# EAGLE design 204_barometer (EAGLE 7.6.0)
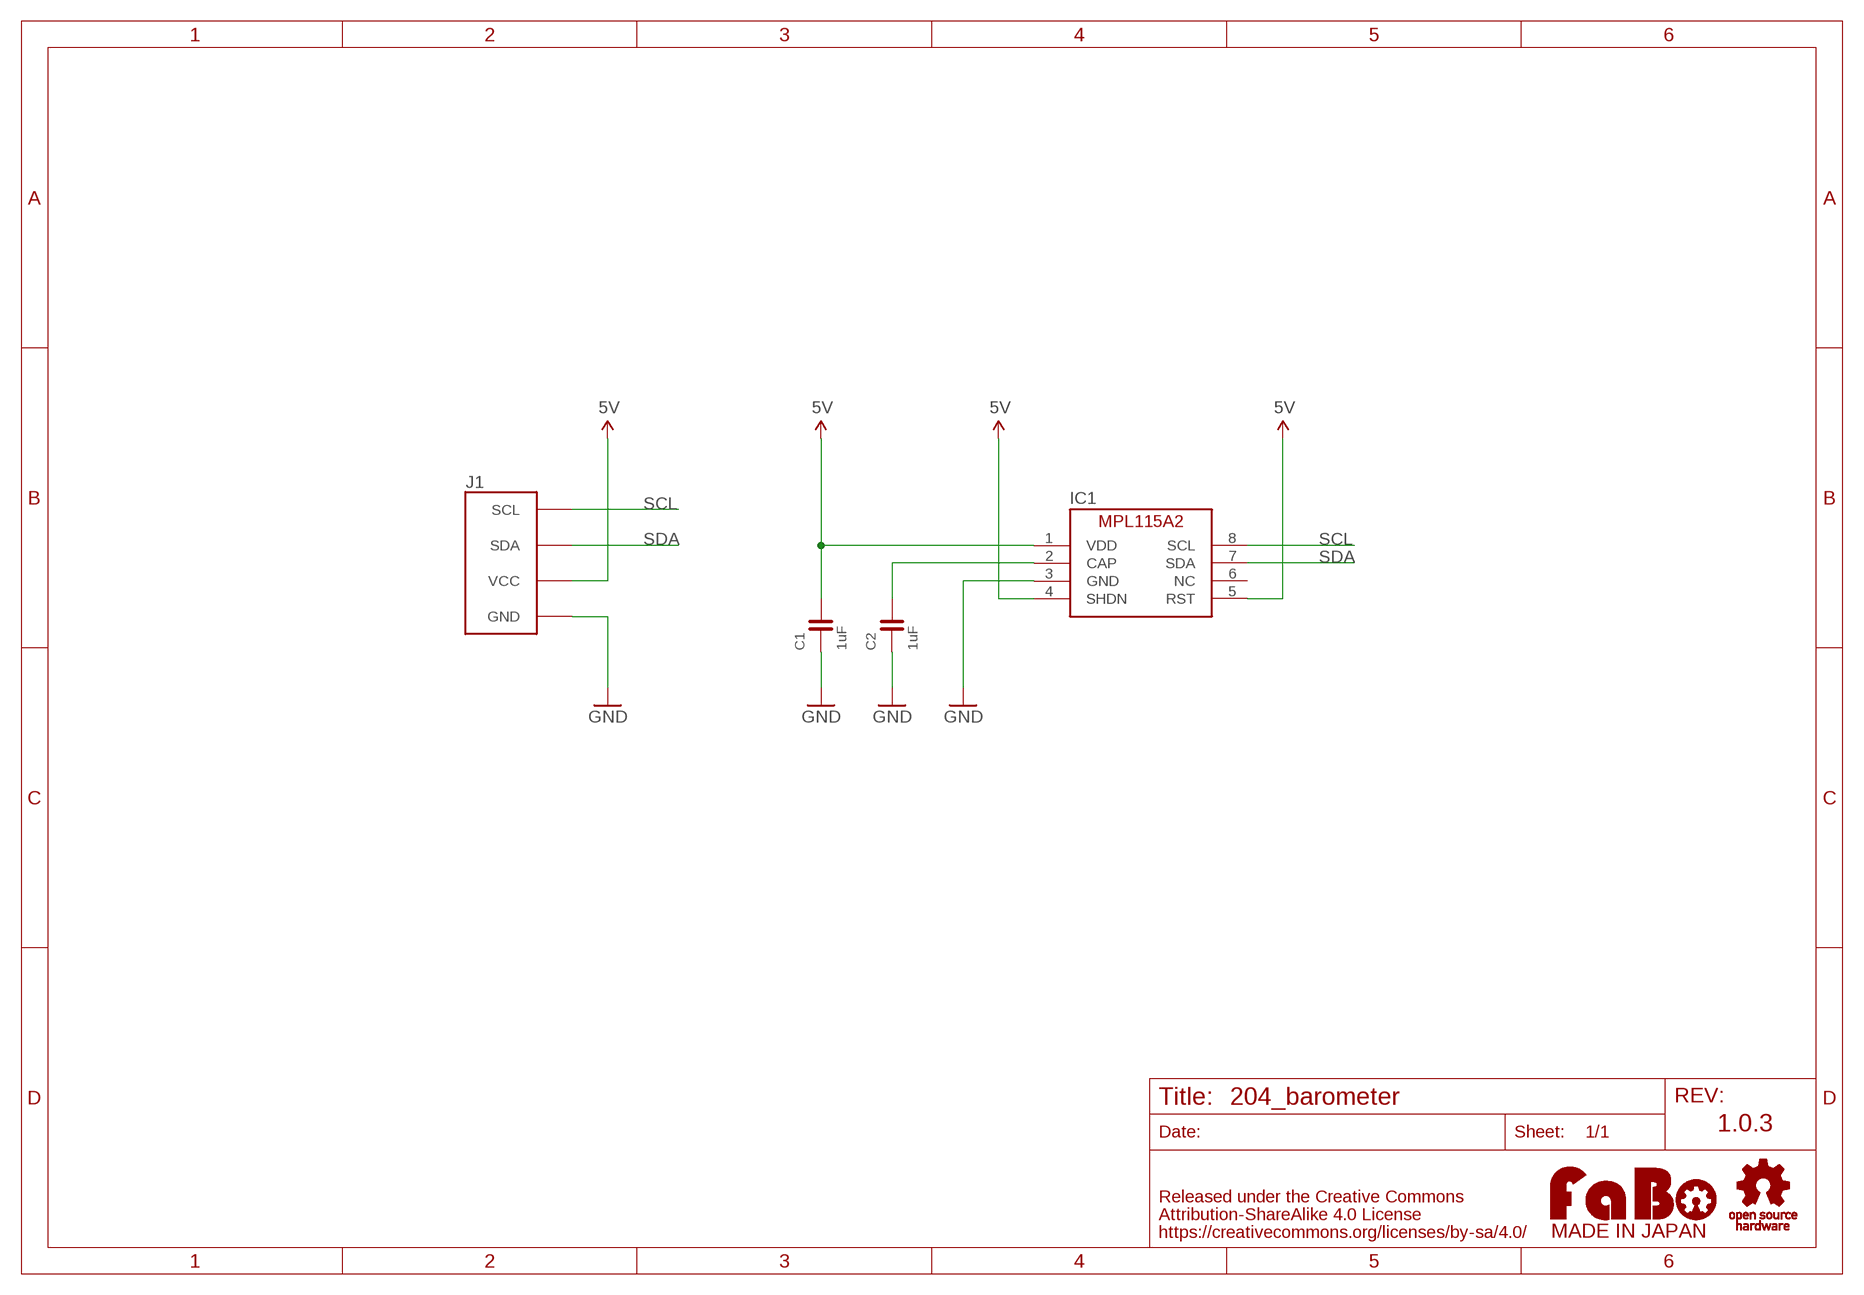
[diagram p0: schematic, sheet 1]

## Parts
C1  1uF  CAPACITOR-0603  [0603]
C2  1uF  CAPACITOR-0603  [0603]
IC1  FS-MPL115A2  [FREESCALE-MPL115A2]
J1  FABO_BRICK_I2C  [FABO_BRICK_I2C]
U$2  LOGO_OSHW-M_BOTTOM  [LOGO_OSHW_M_BOTTOM]
U$4  LOGO_FABO-M  [LOGO_FABO_MS]

## Nets
5V: C1.2 IC1.1(VDD) IC1.4(SHDN) IC1.5(RST) J1.VCC
GND: C1.1 C2.1 IC1.3(GND) J1.GND
N$2: C2.2 IC1.2(CAP)
SCL: IC1.8(SCL) J1.SCL
SDA: IC1.7(SDA) J1.SDA
Unconnected: IC1.6(NC)

## Notes on the sheet
- 1.0.3

## Library data of the parts
C1 C2 = FaBo-Capacitor:CAPACITOR: CAPACITOR
IC1 = FaBo-Mems:FS-MPL115A2: FREESCALE MPL115A2(Atmospheric pressure)
J1 = FaBo-Template:FABO_BRICK_I2C: FaBo Brick I2C
U$2 = FaBo-etc:LOGO_OSHW
U$4 = FaBo-etc:LOGO_FABO

## Board
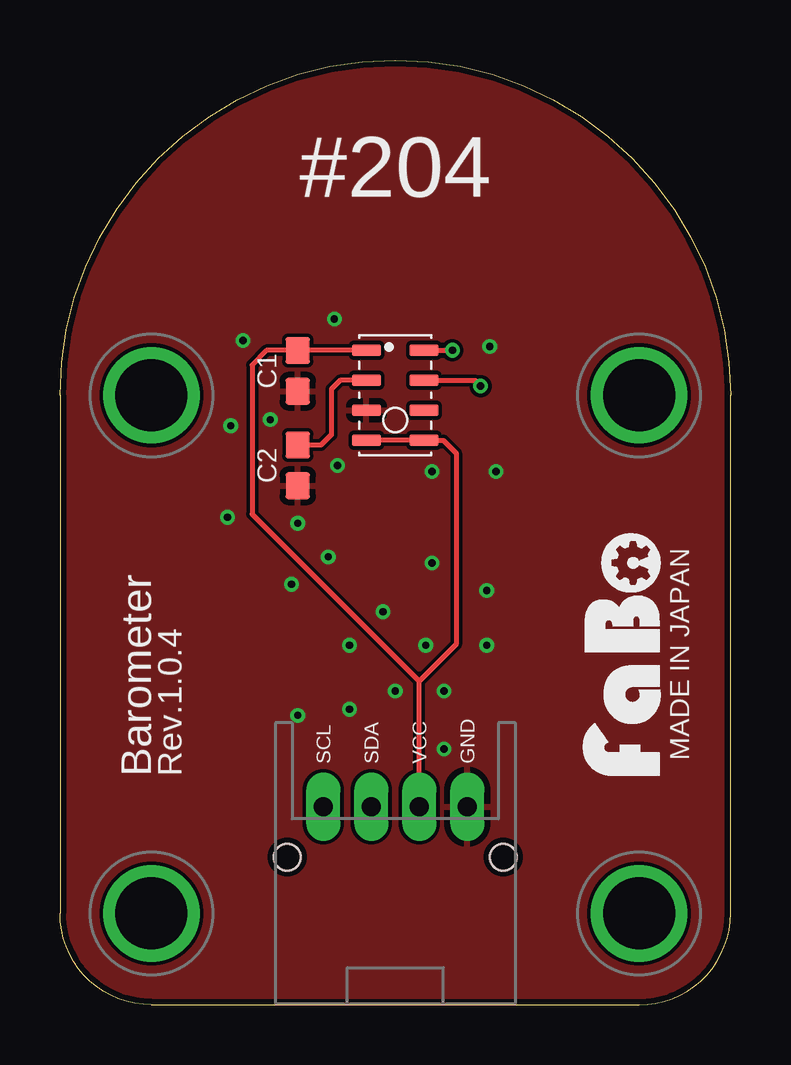
[diagram p1: board, top side]
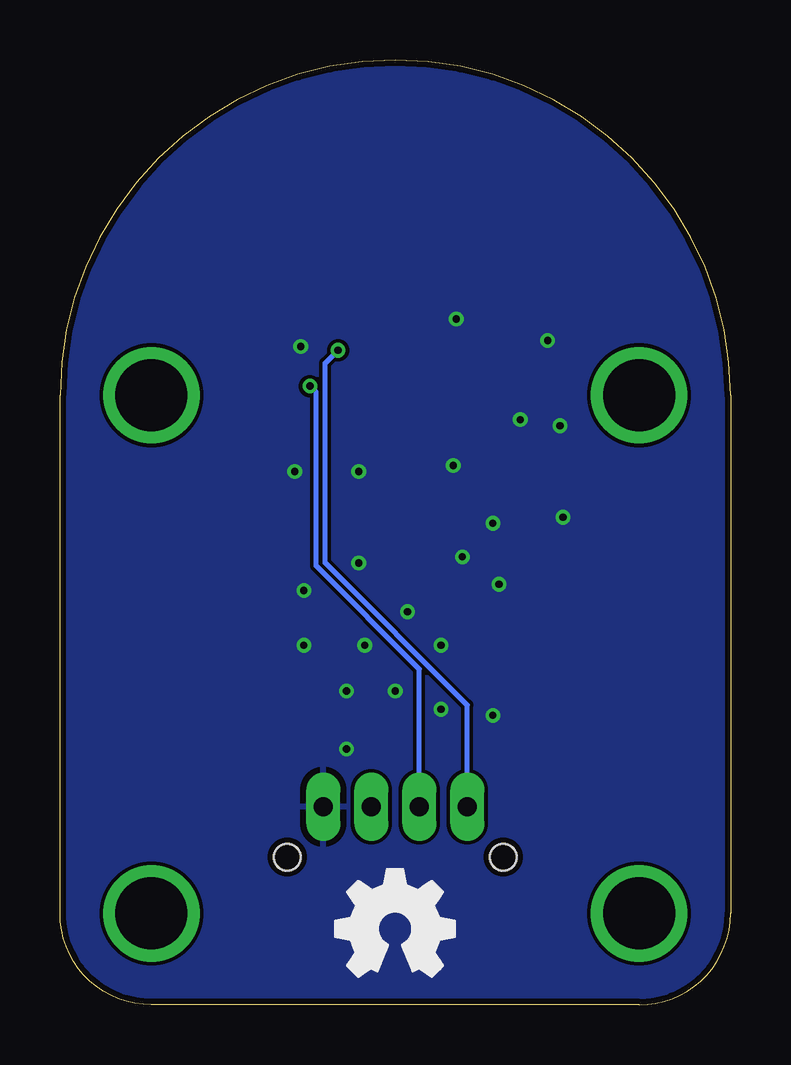
[diagram p2: board, bottom side, seen from below]

Size 27.94 x 39.37 mm. Coordinates in mm from the lower left corner, seen from the top.
Copper layers (1*16): Top 0.035mm / dielectric 1.5mm / Bottom 0.035mm
Design rules "SeeedStudio_2layer_DRU_no_angle_20140221": minimum track width 6mil, minimum drill 12mil, track to track 6mil, track to pad 6mil, pad to pad 6mil, via to via 6mil, smd to smd 0mil, copper to edge 10mil, drill to drill 10mil, minimum pad ring 10mil, minimum via ring 6mil, stop-mask expansion 2mil, vias tented up to drill 100mil, thermal gap 10mil

### Footprints (pad centres in the part's own frame; a part is rotated, then mirrored left to right if it is on the bottom)
0603 = smd 1.1 x 1: 1 -0.85,0; 2 0.85,0
FREESCALE-MPL115A2 = smd 1.2 x 0.5: 1 -1.2,1.875; 2 -1.2,0.625; 3 -1.2,-0.625; 4 -1.2,-1.875; 5 1.2,-1.875; 6 1.2,-0.625; 7 1.2,0.625; 8 1.2,1.875
FABO_BRICK_I2C = drill 0.8 pad 1.422 long: GND 3,-10.795; SCL -3,-10.795; SDA -1,-10.795; VCC 1,-10.795 | drill 3 pad 3.81: P$1 -10.16,6.35; P$2 10.16,6.35; P$3 -10.16,-15.24; P$4 10.16,-15.24 | hole 1.1: -4.5,-12.895; 4.5,-12.895

### Placement (x,y rotation side)
C1  9.91,26.42 90 top
C2  9.91,22.48 90 top
IC1  13.97,25.4 0 top
J1  13.97,19.05 0 top
U$2  13.97,3.17 0 top
U$4  25.4,14.61 90 top

### Tracks (layer width: path | path; a pad name or v marks a point on that pad's centre or on a via)
5V
  Top 0.203: IC1.1 10.16,27.27 C1.2 8.6,27.27 8,26.67 8,20.45 14.97,13.48 | J1.VCC 14.97,13.48 | 14.97,13.48 16.51,15.02 16.51,22.99 15.97,23.52 IC1.5 IC1.4
GND  (via drill 0.3)
  other vias: 11.18,18.67 11.56,22.48 11.43,28.57 7.62,27.69 6.99,20.32 9.65,17.53 13.46,16.38 15.49,18.41 18.16,22.23 17.91,27.43 17.78,17.27 15.24,14.99 13.97,13.08 12.06,14.99 12.06,12.32 9.91,12.06 17.78,14.99 16,10.67 9.91,20.07 15.49,22.23 7.11,24.13 8.76,24.38 16,13.08
  pour Bottom: 0,0 27.94,0 27.94,39.37 0,39.37
  pour Top: 0,0 27.94,0 27.94,39.37 0,39.37
N$2
  Top 0.203: IC1.2 11.67,26.02 11.3,25.65 11.3,23.75 10.88,23.33 C2.2
SCL  (via drill 0.3)
  Top 0.203: IC1.8 v16.35,27.27
  Bottom 0.203: J1.SCL 10.97,12.49 16.89,18.41 16.89,26.74 v16.35,27.27
SDA  (via drill 0.3)
  Top 0.203: IC1.7 17.28,26.02 v17.53,25.78
  Bottom 0.203: v17.53,25.78 17.27,25.53 17.27,18.29 12.97,13.99 J1.SDA

### Text on the board
tPlace: #204 | MADE IN JAPAN | Barometer | Rev.1.0.4